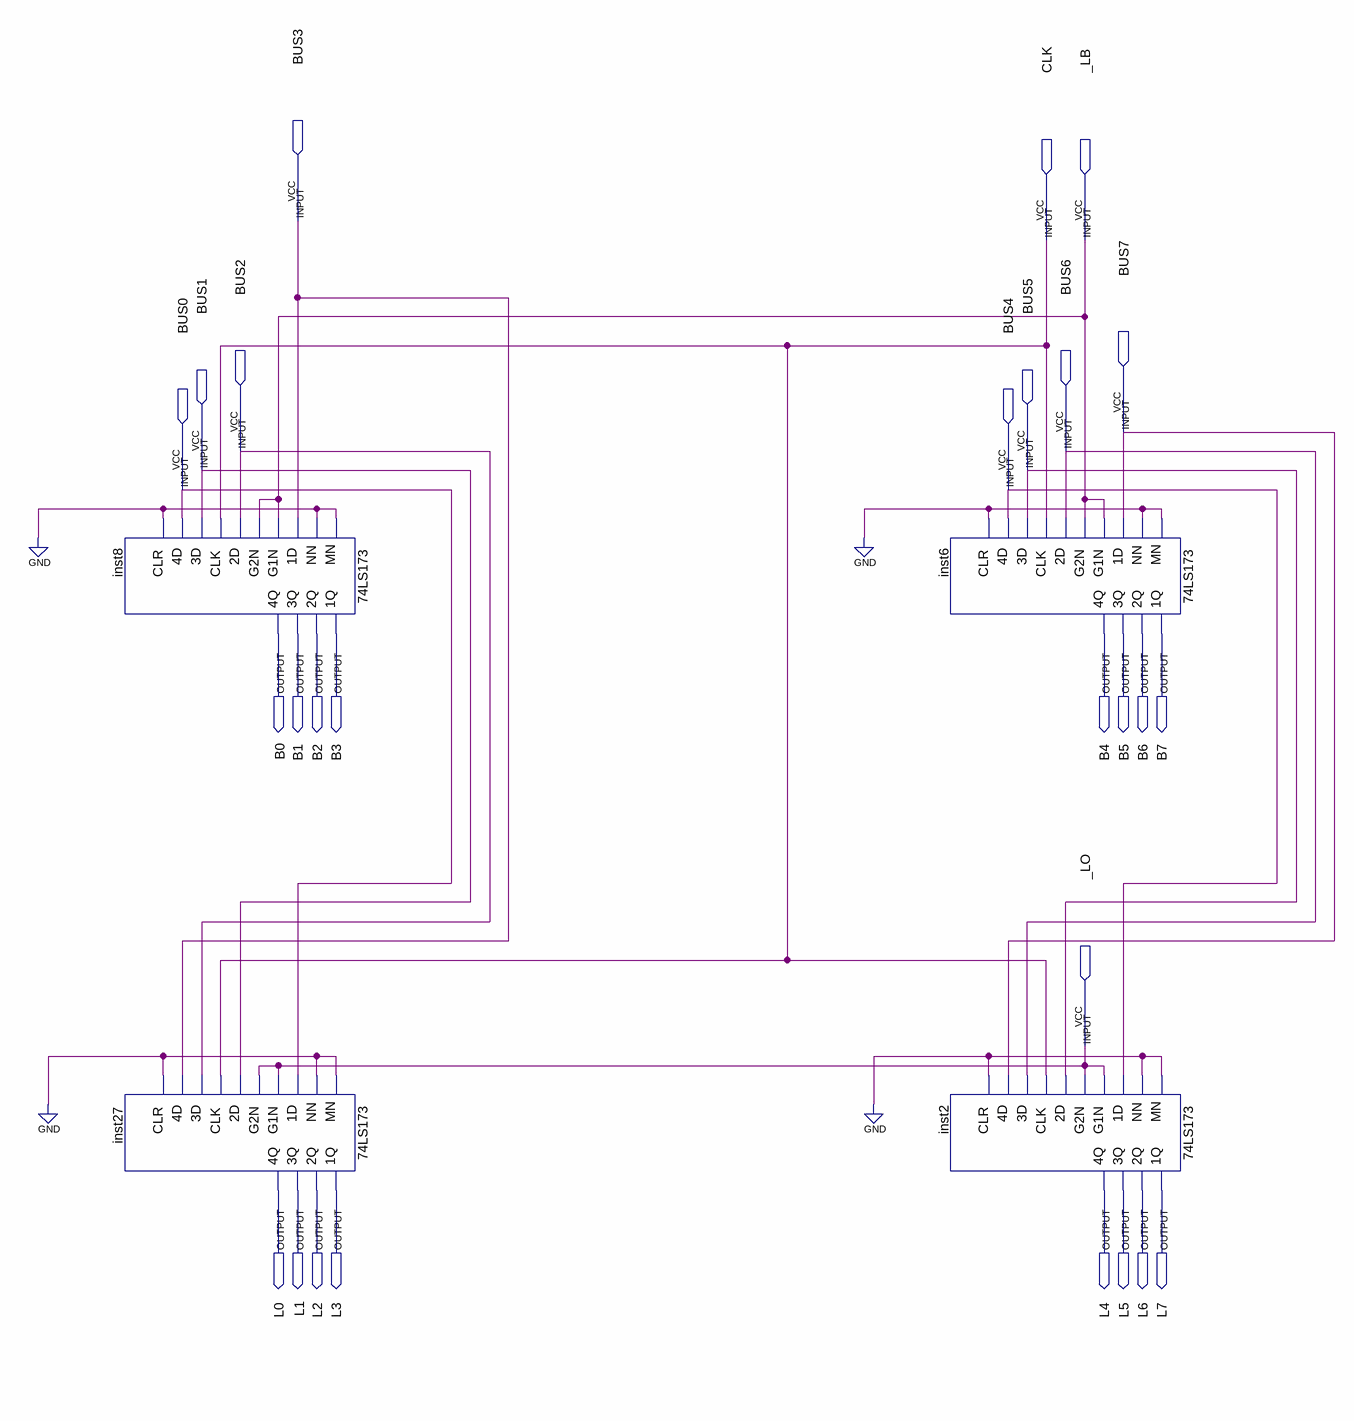
[diagram p0: schematic sheet]
// Quartus schematic SomadorSubtrator, acumulador A, registrador B e circuitos de saida.bdf as structural Verilog: 4 symbols, 27 pins
module \SomadorSubtrator,_acumulador_A,_registrador_B_e_circuitos_de_saida  (
  input  BUS3,
  input  CLK,
  input  _LB,
  input  BUS7,
  input  BUS2,
  input  BUS6,
  input  BUS1,
  input  BUS5,
  input  BUS0,
  input  BUS4,
  input  _LO,
  output B0,
  output B1,
  output B2,
  output B3,
  output B4,
  output B5,
  output B6,
  output B7,
  output L0,
  output L1,
  output L2,
  output L3,
  output L4,
  output L5,
  output L6,
  output L7
);

  \74LS173  inst8 (
    .MN(1'b0), .NN(1'b0), .\1D (BUS3), .G1N(_LB), .G2N(_LB), .\2D (BUS2), .CLK(CLK), .\3D (BUS1),
    .\4D (BUS0), .CLR(1'b0), .\1Q (B3), .\2Q (B2), .\3Q (B1), .\4Q (B0));
  \74LS173  inst27 (
    .MN(1'b0), .NN(1'b0), .\1D (BUS0), .G1N(_LO), .G2N(_LO), .\2D (BUS1), .CLK(CLK), .\3D (BUS2),
    .\4D (BUS3), .CLR(1'b0), .\1Q (L3), .\2Q (L2), .\3Q (L1), .\4Q (L0));
  \74LS173  inst6 (
    .MN(1'b0), .NN(1'b0), .\1D (BUS7), .G1N(_LB), .G2N(_LB), .\2D (BUS6), .CLK(CLK), .\3D (BUS5),
    .\4D (BUS4), .CLR(1'b0), .\1Q (B7), .\2Q (B6), .\3Q (B5), .\4Q (B4));
  \74LS173  inst2 (
    .MN(1'b0), .NN(1'b0), .\1D (BUS4), .G1N(_LO), .G2N(_LO), .\2D (BUS5), .CLK(CLK), .\3D (BUS6),
    .\4D (BUS7), .CLR(1'b0), .\1Q (L7), .\2Q (L6), .\3Q (L5), .\4Q (L4));
endmodule
